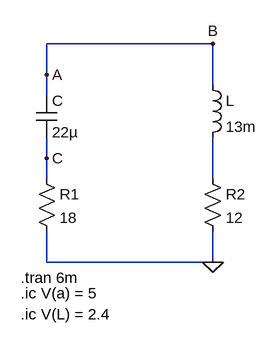
[diagram p0: schematic Descarga.asc]
Descarga.asc, the LTspice schematic file:
Version 4
SHEET 1 880 680
WIRE 352 0 96 0
WIRE 96 48 96 0
WIRE 352 64 352 0
WIRE 96 80 96 48
WIRE 96 176 96 144
WIRE 96 208 96 176
WIRE 352 208 352 144
WIRE 96 336 96 288
WIRE 352 336 352 288
WIRE 352 336 96 336
FLAG 352 336 0
FLAG 96 48 A
FLAG 96 176 C
FLAG 352 0 B
SYMBOL res 80 192 R0
SYMATTR InstName R1
SYMATTR Value 18
SYMBOL res 336 192 R0
SYMATTR InstName R2
SYMATTR Value 12
SYMBOL cap 80 80 R0
SYMATTR InstName C
SYMATTR Value 22µ
SYMBOL ind 336 48 R0
SYMATTR InstName L
SYMATTR Value 13m
TEXT 56 360 Left 2 !.tran 6m
TEXT 56 384 Left 2 !.ic V(a) = 5
TEXT 56 416 Left 2 !.ic V(L) = 2.4

The netlist it stands for:
* Descarga.asc
R1 C 0 18
R2 N001 0 12
C B C 22µ
L B N001 13m
.tran 6m
.ic V(a) = 5
.ic V(L) = 2.4
.backanno
.end